# EAGLE design in9-test-board-v1 (EAGLE 7.7.0)
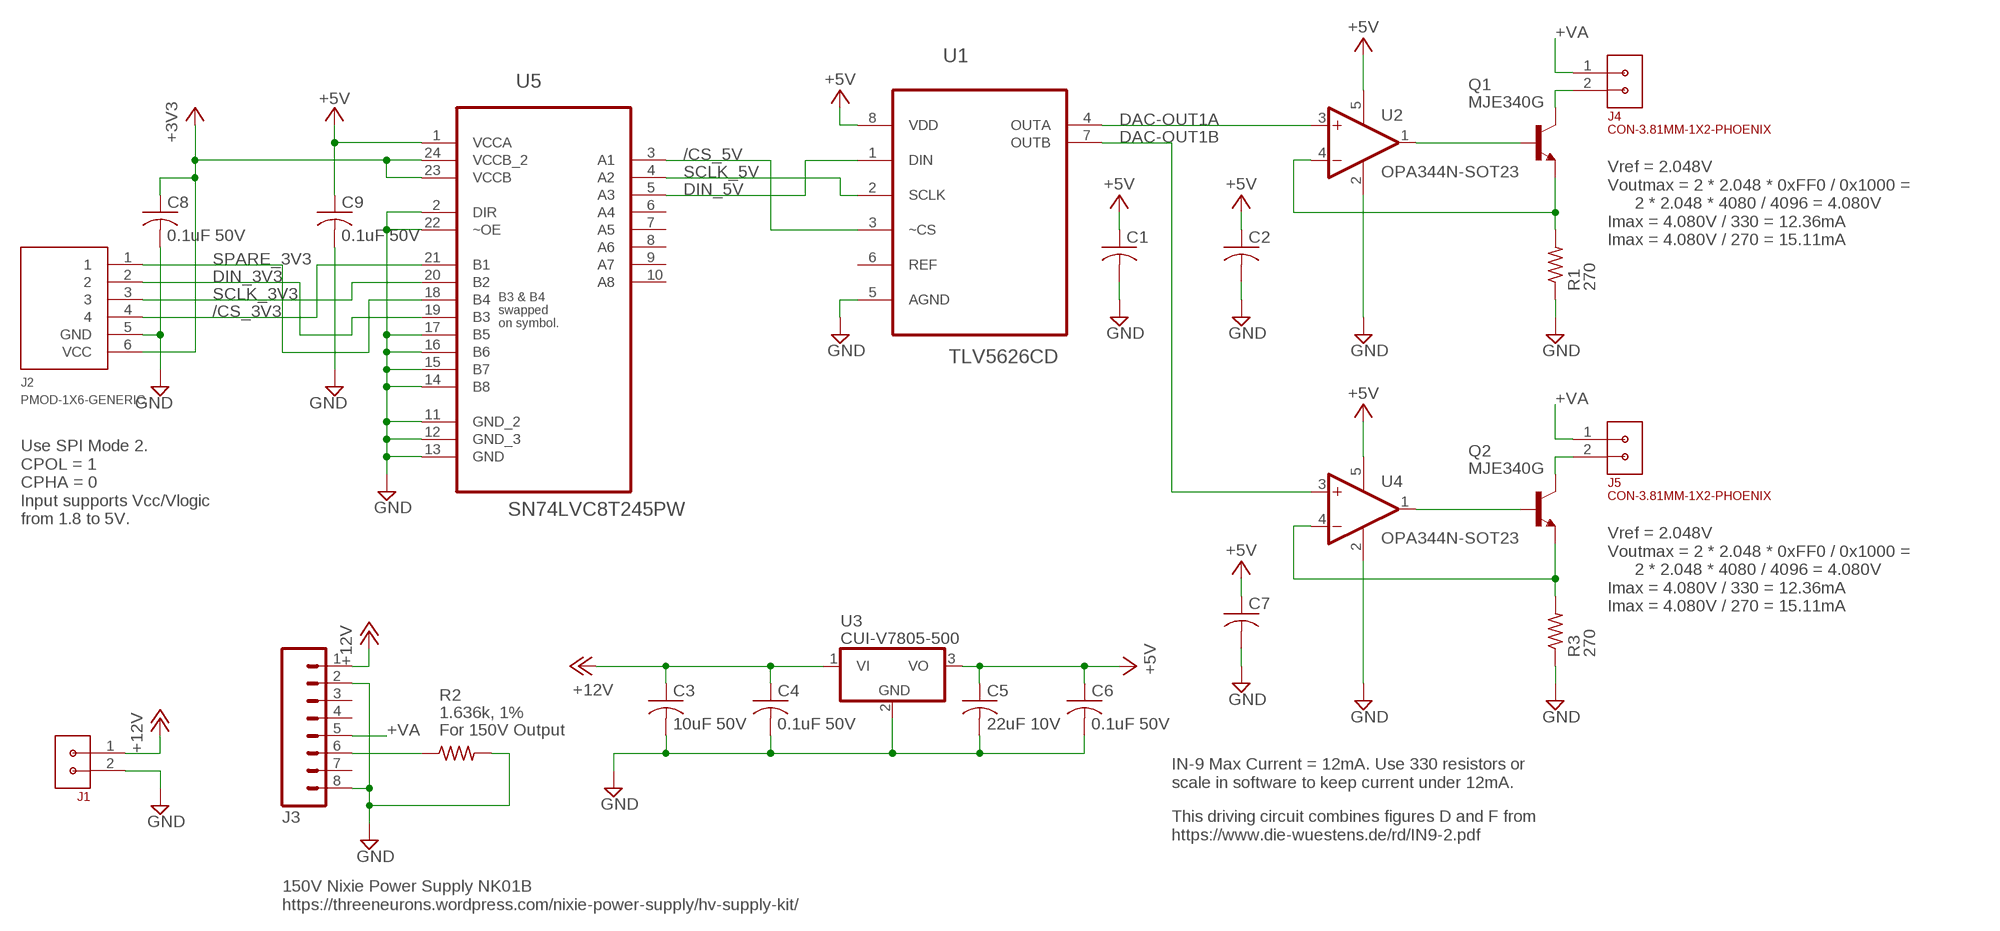
[diagram p0: schematic, sheet 1]

## Parts
C1  C-USC1206K  [C1206K]
C2  C-USC1206K  [C1206K]
C3  10uF 50V  C-USC1210K  [C1210K]
C4  0.1uF 50V  C-USC1206K  [C1206K]
C5  22uF 10V  C-USC1206K  [C1206K]
C6  0.1uF 50V  C-USC1206K  [C1206K]
C7  C-USC1206K  [C1206K]
C8  0.1uF 50V  C-USC1206K  [C1206K]
C9  0.1uF 50V  C-USC1206K  [C1206K]
J1  CON-3.81MM-1X2-PHOENIX-1803426  [CON-PHOENIX-1803426-3.81-1X2]
J2  PMOD-1X6-GENERIC  [CON-PMOD-1X6]
J3  M08  [1X08]
J4  CON-3.81MM-1X2-PHOENIX  [CON-PHOENIX-3.81-1X2-RA]
J5  CON-3.81MM-1X2-PHOENIX  [CON-PHOENIX-3.81-1X2-RA]
Q1  MJE340G  -NPN-TO126V  [TO126V]
Q2  MJE340G  -NPN-TO126V  [TO126V]
R1  270  R-US_R1206  [R1206]
R2  1.636k, 1%  R-US_R1206  [R1206]
R3  270  R-US_R1206  [R1206]
U1  TLV5626CD  [SOIC127P600X175-8N]
U2  OPA344N-SOT23  [SOT23-5]
U3  CUI-V7805-500  CUI-V7803-500  [CUI-78XX-500]
U4  OPA344N-SOT23  [SOT23-5]
U5  SN74LVC8T245PW  SN74AVC8T245PW  [SOP65P640X120-24N]

## Nets
+3V3: C8.1 J2.6(VCC) U5.23(VCCB) U5.24(VCCB_2)
+5V: C1.1 C2.1 C5.1 C6.1 C7.1 C9.1 U1.8(VDD) U2.5(V+) U3.3(VO) U4.5(V+) U5.1(VCCA)
+12V: C3.1 C4.1 J1.1 J3.1 U3.1(VI)
+VA: J3.5 J4.1 J5.1
/CS_3V3: J2.4 U5.21(B1)
/CS_5V: U1.3(~CS) U5.3(A1)
DAC-OUT1A: U1.4(OUTA) U2.3(+IN)
DAC-OUT1B: U1.7(OUTB) U4.3(+IN)
DIN_3V3: J2.2 U5.19(B3)
DIN_5V: U1.1(DIN) U5.5(A3)
GND: C1.2 C2.2 C3.2 C4.2 C5.2 C6.2 C7.2 C8.2 C9.2 J1.2 J2.5(GND) J3.2 J3.8 R1.1 R2.2 R3.1 U1.5(AGND) U2.2(V-) U3.2(GND) U4.2(V-) U5.2(DIR) U5.11(GND_2) U5.12(GND_3) U5.13(GND) U5.14(B8) U5.15(B7) U5.16(B6) U5.17(B5) U5.22(~OE)
N$1: Q1.1(E) R1.2 U2.4(-IN)
N$3: Q1.3(B) U2.1(OUT)
N$4: J3.6 R2.1
N$10: Q2.1(E) R3.2 U4.4(-IN)
N$12: Q2.3(B) U4.1(OUT)
OUT1A: J4.2 Q1.2(C)
OUT1B: J5.2 Q2.2(C)
SCLK_3V3: J2.3 U5.20(B2)
SCLK_5V: U1.2(SCLK) U5.4(A2)
SPARE_3V3: J2.1 U5.18(B4)
Unconnected: J3.3 J3.4 J3.7 U1.6(REF) U5.6(A4) U5.7(A5) U5.8(A6) U5.9(A7) U5.10(A8)

## Notes on the sheet
- Vref = 2.048V
  Voutmax = 2 * 2.048 * 0xFF0 / 0x1000 = 
        2 * 2.048 * 4080 / 4096 = 4.080V
  Imax = 4.080V / 330 = 12.36mA
  Imax = 4.080V / 270 = 15.11mA
- B3 & B4
  swapped
  on symbol.
- Use SPI Mode 2.
  CPOL = 1
  CPHA = 0
  Input supports Vcc/Vlogic
  from 1.8 to 5V.
- Vref = 2.048V
  Voutmax = 2 * 2.048 * 0xFF0 / 0x1000 = 
        2 * 2.048 * 4080 / 4096 = 4.080V
  Imax = 4.080V / 330 = 12.36mA
  Imax = 4.080V / 270 = 15.11mA
- For 150V Output
- IN-9 Max Current = 12mA. Use 330 resistors or
  scale in software to keep current under 12mA.
- This driving circuit combines figures D and F from
  https://www.die-wuestens.de/rd/IN9-2.pdf
- 150V Nixie Power Supply NK01B
  https://threeneurons.wordpress.com/nixie-power-supply/hv-supply-kit/

## Library data of the parts
C1 C2 C7 = rcl:C-US: CAPACITOR, American symbol
C3 = rcl:C-US: CAPACITOR, American symbol; MFR: KEMET; MFR_PART_NO: C1210C106K5RACTU
C4 C6 C8 C9 = rcl:C-US: CAPACITOR, American symbol; MFR: KEMET; MFR_PART_NO: C1206S104M5RACTU
C5 = rcl:C-US: CAPACITOR, American symbol; MFR: KEMET; MFR_PART_NO: C1206C226K8RAC7800
J1 = 0GlenConnectors:CON-3.81MM-1X2-PHOENIX-1803426
J2 = 0GlenConnectors:PMOD-1X6-GENERIC
J3 = SparkFun:M08: Header 8 Standard 8-pin 0.1" header. Use with straight break away headers (SKU : PRT-00116), right angle break away headers (PRT-00553), swiss pins (PRT-00743), machine pins (PRT-00117), and female headers (PRT-00115).
J4 J5 = 0GlenConnectors:CON-3.81MM-1X2-PHOENIX
Q1 Q2 = transistor:*-NPN-: NPN Transistror BF959 corrected 2008.03.06
R1-R3 = rcl:R-US_: RESISTOR, American symbol
U1 = Texas Instruments_By_element14_Batch_1:TLV5626CD: 2.7-V TO 5.5-V LOW-POWER DUAL 8-BIT DIGITAL-TO-ANALOG CONVERTER WITH INTERNAL REFERENCE AND POWER DOWN; MPN: TLV5626CD; OC_FARNELL: 4512819; OC_NEWARK: 19C9016; PACKAGE: SOIC-8; SUPPLIER: Texas Instruments
U2 U4 = linear:OPA*-SOT23: Single Operational Amplifier Low Power, Single-Supply, Rail-To-Rail Operational Amplifier Source: http://focus.ti.com/lit/ds/symlink/opa2345.pdf
U3 = GlenPartsLibrary:CUI-V7803-500
U5 = Texas Instruments_By_element14_Batch_1:SN74AVC8T245PW: TRANSCEIVER; MPN: SN74AVC8T245PW; OC_FARNELL: 1053490; OC_NEWARK: 10J9626; PACKAGE: TSSOP-24; SUPPLIER: Texas Instruments

## Board
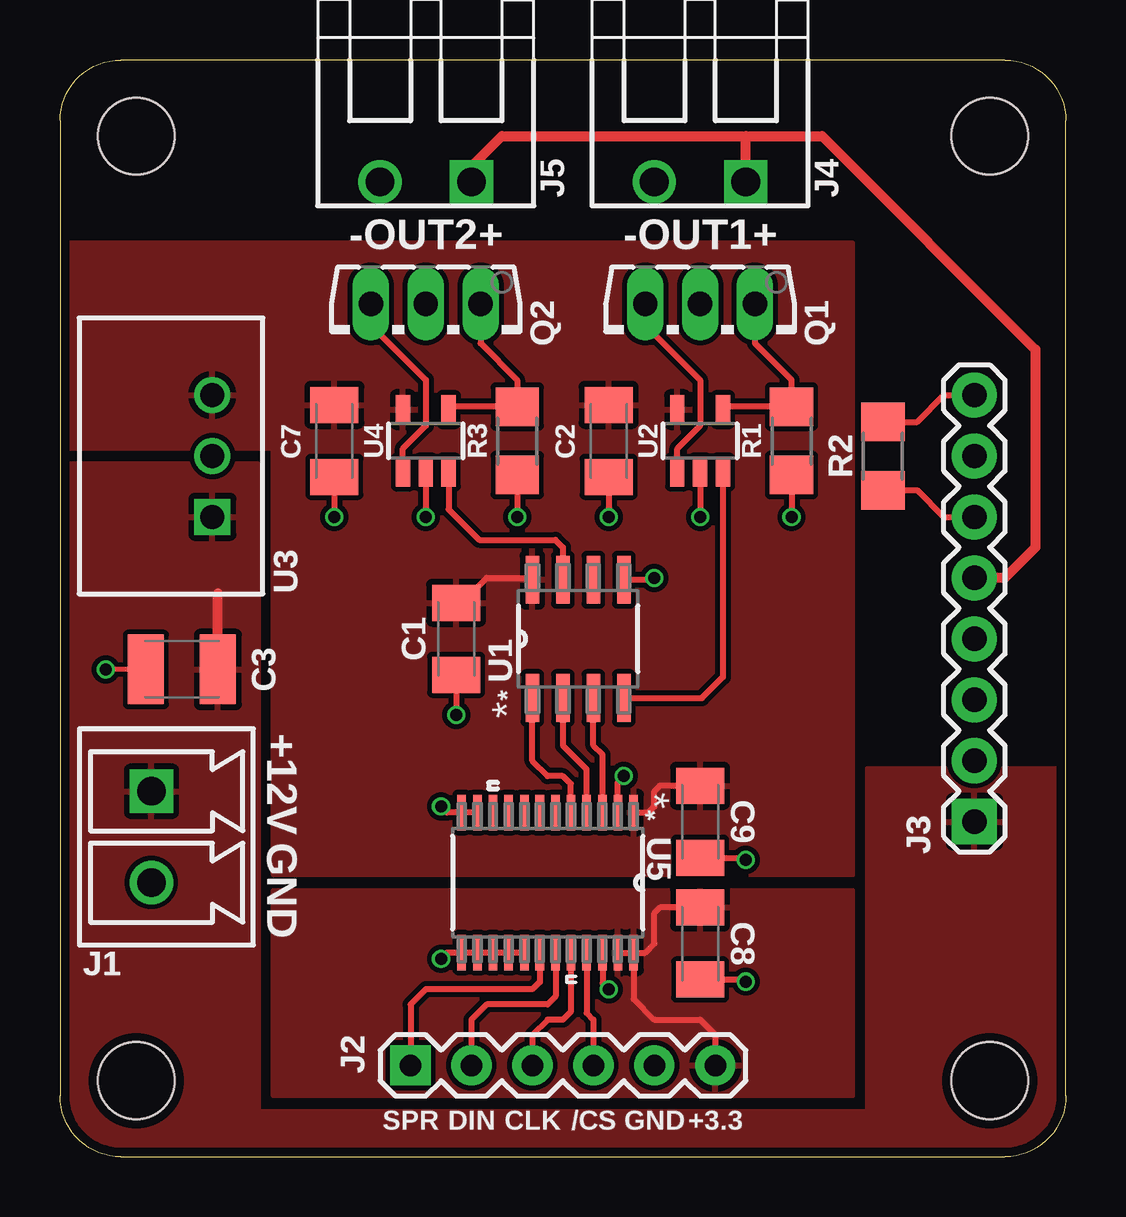
[diagram p1: board, top side]
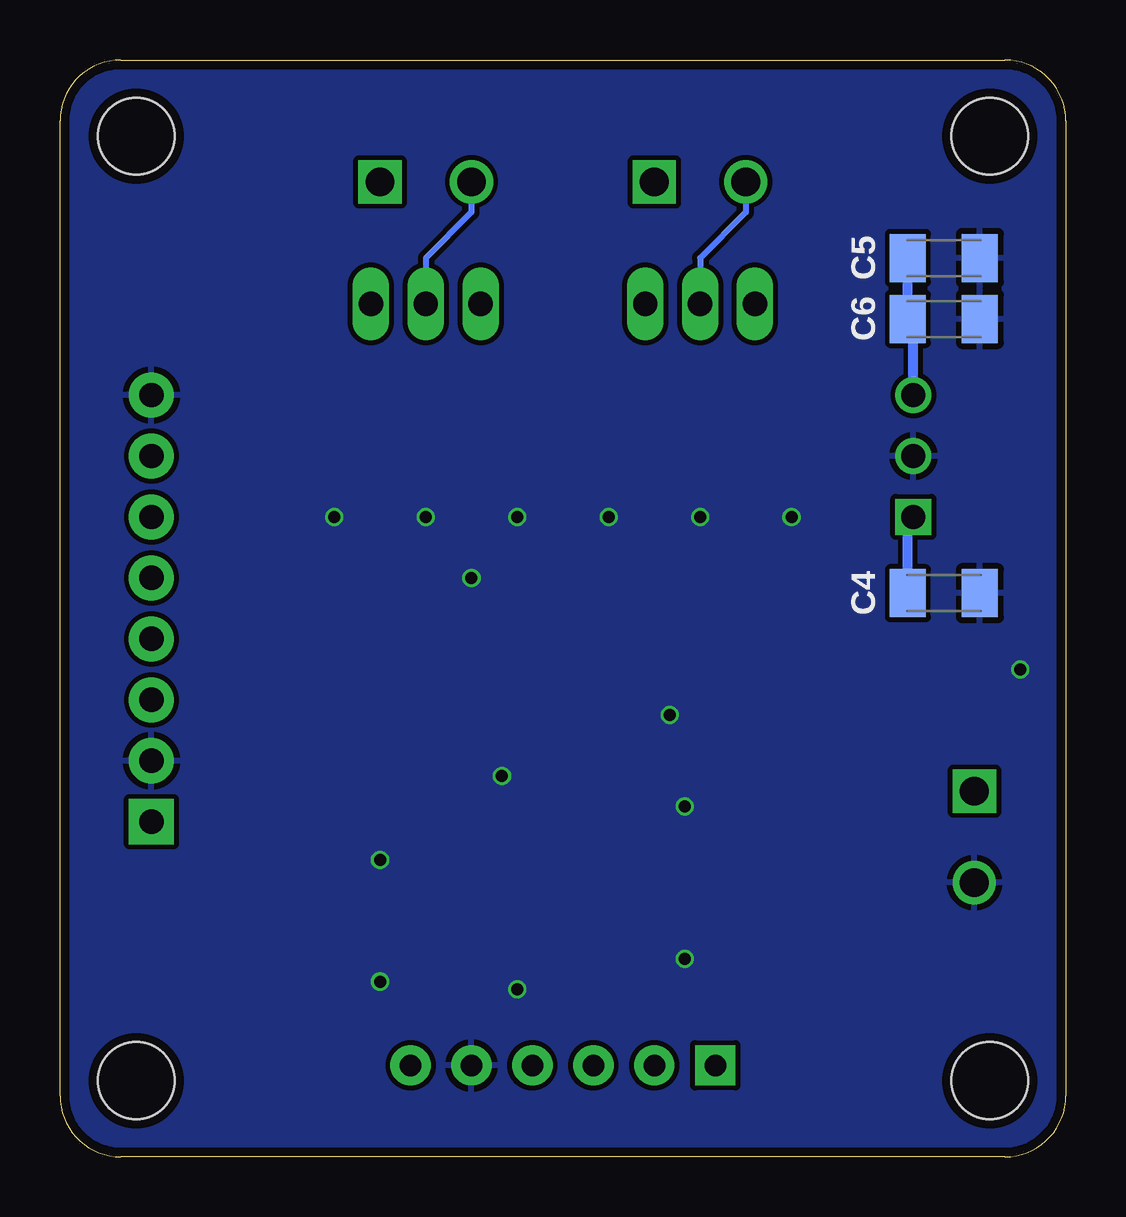
[diagram p2: board, bottom side, seen from below]

Size 41.91 x 45.72 mm. Coordinates in mm from the lower left corner, seen from the top.
Outline: 2.54,0 39.37,0 arc90 41.91,2.54 41.91,43.18 arc90 39.37,45.72 2.54,45.72 arc90 0,43.18 0,2.54 arc90 2.54,0
Copper layers (1*16): Top 0.035559375mm / dielectric 1.6mm / Bottom 0.035559375mm
Design rules "oshpark-2layer-2018": minimum track width 6mil, minimum drill 10mil, track to track 6mil, track to pad 6mil, pad to pad 6mil, via to via 6mil, smd to smd 6mil, copper to edge 15mil, drill to drill 6mil, minimum pad ring 5mil, minimum via ring 5mil, stop-mask expansion 2.5mil, vias tented up to drill 0mil, thermal gap 10mil
Holes 3.2 mm at 3.17,3.17 3.17,42.55 38.73,42.55 38.73,3.17

### Footprints (pad centres in the part's own frame; a part is rotated, then mirrored left to right if it is on the bottom)
C1206K = smd 1.5 x 2: 1 -1.5,0; 2 1.5,0
C1210K = smd 1.5 x 2.9: 1 -1.5,0; 2 1.5,0
CON-PHOENIX-1803426-3.81-1X2 = drill 1.2 square: 1 0,0 | drill 1.2: 2 3.81,0
CON-PMOD-1X6 = drill 0.9 pad 1.676 square: 1 0,6.35 | drill 0.9 pad 1.676: 2 0,3.81; 3 0,1.27; 4 0,-1.27; 5 0,-3.81; 6 0,-6.35
1X08 = drill 1.016 pad 1.88 square: 1 0,0 | drill 1.016 pad 1.88: 2 2.54,0; 3 5.08,0; 4 7.62,0; 5 10.16,0; 6 12.7,0; 7 15.24,0; 8 17.78,0
CON-PHOENIX-3.81-1X2-RA = drill 1.2 square: 1 0,0 | drill 1.2: 2 3.81,0
TO126V = drill 1.016 long: 1 -2.286,-1.27; 2 0,-1.27; 3 2.286,-1.27
R1206 = smd 1.6 x 1.803: 1 -1.422,0; 2 1.422,0
SOIC127P600X175-8N = smd 1.981 x 0.559: 1 -2.464,1.905; 2 -2.464,0.635; 3 -2.464,-0.635; 4 -2.464,-1.905; 5 2.464,-1.905; 6 2.464,-0.635; 7 2.464,0.635; 8 2.464,1.905
SOT23-5 = smd 0.6 x 1.2: 1 -0.95,-1.306; 2 0,-1.306; 3 0.95,-1.306; 4 0.95,1.306; 5 -0.95,1.306
CUI-78XX-500 = drill 1 square: 1 0,0 | drill 1: 2 2.54,0; 3 5.08,0
SOP65P640X120-24N = smd 1.473 x 0.356: 1 -2.921,3.581; 2 -2.921,2.921; 3 -2.921,2.286; 4 -2.921,1.626; 5 -2.921,0.965; 6 -2.921,0.33; 7 -2.921,-0.33; 8 -2.921,-0.965; 9 -2.921,-1.626; 10 -2.921,-2.286; 11 -2.921,-2.921; 12 -2.921,-3.581; 13 2.921,-3.581; 14 2.921,-2.921; 15 2.921,-2.286; 16 2.921,-1.626; 17 2.921,-0.965; 18 2.921,-0.33; 19 2.921,0.33; 20 2.921,0.965; 21 2.921,1.626; 22 2.921,2.286; 23 2.921,2.921; 24 2.921,3.581

### Placement (x,y rotation side)
C1  16.51,21.59 270 top
C2  22.86,29.84 270 top
C3  5.08,20.32 180 top
C4  5.08,23.5 0 bottom
C5  5.08,37.47 0 bottom
C6  5.08,34.92 0 bottom
C7  11.43,29.84 270 top
C8  26.67,8.89 270 top
C9  26.67,13.97 270 top
J1  3.81,15.24 270 top
J2  20.95,3.81 90 top
J3  38.1,13.97 90 top
J4  28.57,40.64 180 top
J5  17.14,40.64 180 top
Q1  26.67,34.29 180 top
Q2  15.24,34.29 180 top
R1  30.48,29.84 90 top
R2  34.29,29.21 90 top
R3  19.05,29.84 90 top
U1  21.59,21.59 90 top
U2  26.67,29.84 0 top
U3  6.35,26.67 90 top
U4  15.24,29.84 0 top
U5  20.32,11.43 270 top

### Tracks (layer width: path | path; a pad name or v marks a point on that pad's centre or on a via)
+3V3
  Top 0.254: U5.23 U5.24 | U5.24 24.38,8.51 24.77,8.89 24.77,10.16 25,10.39 C8.1 | U5.24 23.9,6.58 24.77,5.71 26.67,5.71 27.3,5.08 J2.6
  pour Top (isolate 0.203): 8.89,11.11 33.02,11.11 33.02,2.54 8.89,2.54
+5V
  Top 0.254: C1.1 16.74,23.09 17.78,24.13 19.61,24.13 U1.8 | U5.1 24.51,14.35 24.77,14.61 24.77,15.24 25,15.47 C9.1
  Bottom 0.406: U3.3 6.35,34.7 C6.1 C5.1
  pour Top (isolate 0.203): 0,38.1 33.02,38.1 33.02,11.75 8.89,11.75 8.89,29.53 0,29.53
+12V
  Top 0.406: C3.1 C4.1
  Bottom 0.406: C4.1 6.58,26.44 U3.1
  pour Top (isolate 0.203): 0,28.89 8.26,28.89 8.26,1.91 33.66,1.91 33.66,16.19 41.91,16.19 41.91,0 0,0
+VA
  Top 0.406: J3.5 39.37,24.13 40.64,25.4 40.64,33.66 31.75,42.55 28.57,42.55 | J5.1 17.14,41.27 18.41,42.55 28.57,42.55 | J4.1 28.57,42.55
/CS_3V3
  Top 0.254: U5.21 21.95,5.99 22.23,5.71 J2.4
/CS_5V
  Top 0.254: U5.3 22.61,16.76 22.23,17.14 U1.3
DAC-OUT1A
  Top 0.254: U1.4 26.75,19.13 27.62,20 U2.3
DAC-OUT1B
  Top 0.254: U4.3 16.19,26.99 17.46,25.72 20.64,25.72 20.95,25.4 U1.7
DIN_3V3
  Top 0.254: U5.19 20.65,6.68 20.32,6.35 17.78,6.35 17.14,5.71 J2.2
DIN_5V
  Top 0.254: U5.5 21.29,15.54 20.95,15.88 20.32,15.88 19.68,16.51 U1.1
GND  (via drill 0.5)
  Top 0.203: C3.2 v1.91,20.32
  Top 0.254: R2.2 35.71,30.63 36.83,31.75 J3.8 | R1.1 v30.48,26.67 | U2.2 v26.67,26.67 | C2.2 v22.86,26.67 | C7.2 v11.43,26.67 | U4.2 v15.24,26.67 | R3.1 v19.05,26.67 | C1.2 v16.51,18.41 | U1.5 24.69,24.05 v24.77,24.13 | C9.2 28.34,12.47 v28.57,12.38 | C8.2 28.34,7.39 v28.57,7.3 | U5.11 U5.12 16.13,14.35 v15.88,14.61 | U5.13 U5.14 U5.15 U5.16 U5.17 16.13,8.51 v15.88,8.26 | U5.22 22.61,7.24 v22.86,6.99 | U5.2 23.24,15.62 v23.5,15.88
  pour Bottom (isolate 0.203): 0,0 41.91,0 41.91,45.72 0,45.72
N$1
  Top 0.254: U2.4 27.74,31.27 R1.2 30.48,32.38 28.96,33.91 Q1.1
N$3
  Top 0.254: U2.1 25.72,29.53 26.67,30.48 26.67,32.38 24.38,34.67 Q1.3
N$4
  Top 0.254: R2.1 35.71,27.79 36.83,26.67 J3.6
N$10
  Top 0.254: Q2.1 17.53,33.91 19.05,32.38 R3.2 16.31,31.27 U4.4
N$12
  Top 0.254: Q2.3 12.95,34.67 15.24,32.38 15.24,30.48 14.29,29.53 U4.1
OUT1A
  Bottom 0.254: J4.2 24.77,39.37 26.67,37.47 Q1.2
OUT1B
  Bottom 0.254: J5.2 13.34,39.37 15.24,37.47 Q2.2
SCLK_3V3
  Top 0.254: U5.20 21.29,6.04 20.95,5.71 20.32,5.71 19.68,5.08 J2.3
SCLK_5V
  Top 0.254: U5.4 21.95,16.15 20.95,17.14 U1.2
SPARE_3V3
  Top 0.254: U5.18 19.99,7.29 19.68,6.99 15.24,6.99 14.61,6.35 J2.1

### Text on the board
_tsilk: J5 | J4 | -OUT2+ | -OUT1+ | Q2 | Q1 | C7 | U4 | R3 | C2 | U2 | R1 | R2 | U3 | C1 | C3 | U1 | * | +12V | * | C9 | U5 | J3 | J3 | GND | J1 | C8 | J2 | SPR | DIN | CLK | /CS | GND | +3.3
_bsilk: C5 | C6 | C4